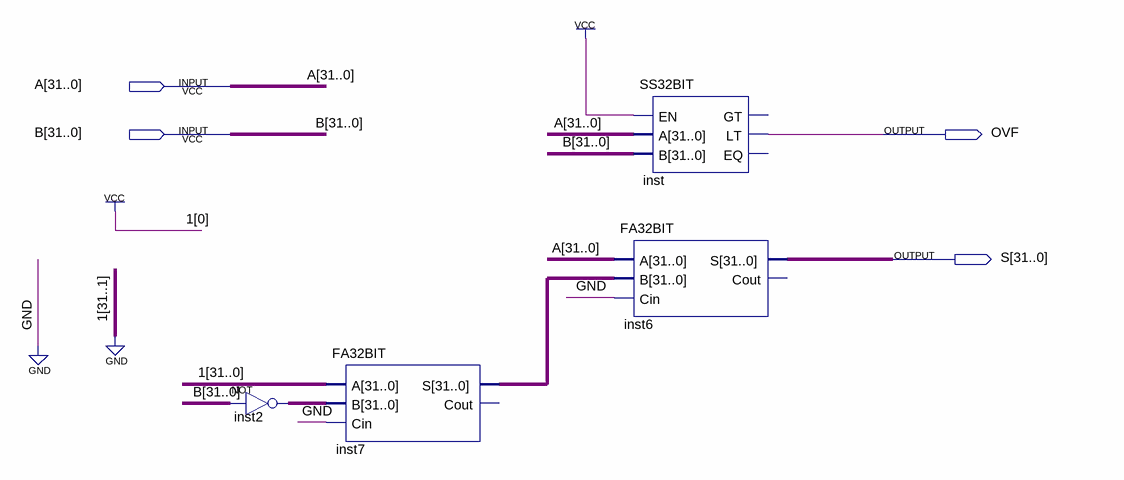
[diagram p0: schematic sheet]
// Quartus schematic SUB32BIT.bdf as structural Verilog: 4 symbols, 4 pins
module SUB32BIT (
  input  [31:0] A,
  input  [31:0] B,
  output OVF,
  output [31:0] S
);

  wire [31:0] inst2_out, inst7_s;

  assign inst2_out = ~B;  // NOT inst2, 32 bits wide
  FA32BIT inst7 (.A(32'b00000000000000000000000000000001), .B(inst2_out), .Cin(1'b0), .S(inst7_s));  // open: Cout
  SS32BIT inst (.EN(1'b1), .A(A), .B(B), .LT(OVF));  // open: GT, EQ
  FA32BIT inst6 (.A(A), .B(inst7_s), .Cin(1'b0), .S(S));  // open: Cout
endmodule
